# Altium schematic sheet 智能家居-开关-电力板.SchDoc
size A4
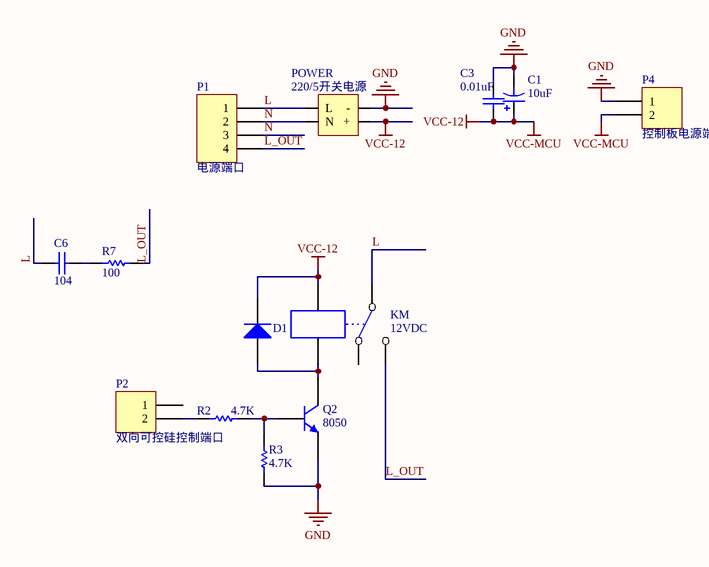
[diagram p0: 智能家居-开关-电力板.SchDoc]

## Parts
C1  value 10uF  [CD5]  (hidden comment: Cap Pol1)
C3  0.01uF  [0.1UF]
C6  value 104  [0.1UF/275V]  (hidden comment: Cap)
D1  Diode  [DIODE]  (value not drawn)
KM  12VDC  [SRD_RELAY]
P1  电源端口  [JK128-500-4P]
P2  双向可控硅控制端口  [TJC3-2A]
P4  控制板电源端口  [TJC3-2A]
POWER  220/5开关电源  [220/5开关电源]
Q2  8050  [TO-92D]
R2  4.7K  [AXIAL0.3]
R3  4.7K  [AXIAL0.3]
R7  100  [AXIAL0.3]

## Nets
GND: C1.2 C3.2 P4.1 POWER.3(-) Q2.1(E) R3.2
VCC-12: C1.1 C3.1 D1.2(K) KM.1 P4.2 POWER.4(+)  [also labelled VCC-MCU]
L: C6.2 KM.5(COM) P1.1 POWER.1(L)
L_OUT: KM.3 P1.4 R7.1
N: P1.2 P1.3 POWER.2(N)
NetC6_1: C6.1 R7.2
NetD1_1: D1.1(A) KM.4 Q2.3(C)
NetP2_2: P2.2 R2.1
NetQ2_2: Q2.2(B) R2.2 R3.1

Not connected (* = marked no-connect by the designer): KM 2; P2 1

## Library data of the parts
C1 = Cap Pol1: Polarized Capacitor (Radial); Published: 8-Jun-2000; LatestRevisionDate: 17-Jul-2002; LatestRevisionNote: Re-released for DXP Platform.; PackageReference: RB7.6-15; Publisher: Altium Limited; PackageDescription: Polarized Capacitor (Radial); 2 Leads
C3 C6 = Cap: Capacitor; Published: 8-Jun-2000; LatestRevisionDate: 17-Jul-2002; LatestRevisionNote: Re-released for DXP Platform.; Publisher: Altium Limited; PackageDescription: Radial Cap, Thru-Hole; 2 Leads; 0.3 in Pin Spacing
  C3: PackageReference: 0.1UF; Value: 0.01uF
  C6: PackageReference: RAD-0.3
D1 = Diode: Default Diode; Published: 8-Jun-2000; LatestRevisionDate: 17-Jul-2002; LatestRevisionNote: Re-released for DXP Platform.; PackageVersion: Sep-1996; PackageReference: SMC; Publisher: Altium Limited; PackageDescription: DO-214-AB/SMC; 2 C-Bend Leads; Body 7.9 x 5.9 mm, inc. leads (LxW); Code_JEDEC: DO-214-AB
KM = SRD-12VDC
P1 = Header 4: Header, 4-Pin; LatestRevisionDate: 17-Jul-2002; LatestRevisionNote: Re-released for DXP Platform.; Publisher: Altium Limited
P2 P4 = Header 2: Header, 2-Pin; LatestRevisionDate: 17-Jul-2002; LatestRevisionNote: Re-released for DXP Platform.; Publisher: Altium Limited
Q2 = NPN: NPN Bipolar Transistor; Published: 8-Jun-2000; LatestRevisionDate: 17-Jul-2002; LatestRevisionNote: Re-released for DXP Platform.; PackageReference: TO-226-AA; Publisher: Altium Limited; PackageDescription: TO, Flat Index; 3 In-Line, Axial Leads; Body Dia. 4.8mm; Leads 0.55 x 0.51 mm (max); Code_JEDEC: TO-226-AA
R2 R3 R7 = Res1: Resistor; Value: 1K; Published: 8-Jun-2000; Revision: July-2002: Re-released for DXP Platform.; Publisher: Altium Limited